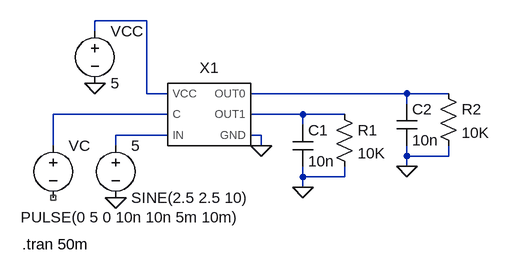
[diagram p0: schematic demux_test.asc]
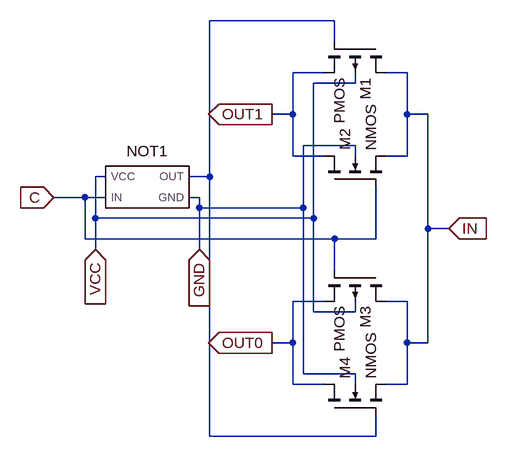
[diagram p1: sub-circuit demux_2to1.asc]
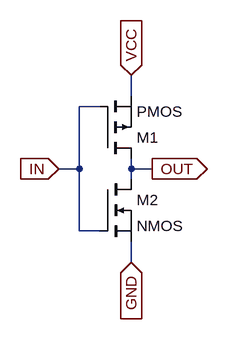
[diagram p2: sub-circuit not.asc]
demux_test.asc, the LTspice schematic file:
Version 4.1
SHEET 1 880 680
WIRE 112 0 32 0
WIRE 32 16 32 0
WIRE 112 112 112 0
WIRE 144 112 112 112
WIRE 512 112 272 112
WIRE 576 112 512 112
WIRE 512 128 512 112
WIRE 144 144 -32 144
WIRE 352 144 272 144
WIRE 416 144 352 144
WIRE 352 160 352 144
WIRE 144 176 64 176
WIRE 288 176 272 176
WIRE -32 192 -32 144
WIRE 64 192 64 176
WIRE 288 192 288 176
WIRE 512 208 512 192
WIRE 576 208 576 192
WIRE 576 208 512 208
WIRE 512 224 512 208
WIRE 352 240 352 224
WIRE 416 240 416 224
WIRE 416 240 352 240
WIRE 352 256 352 240
FLAG 64 272 0
FLAG 32 96 0
FLAG 288 192 0
FLAG 352 256 0
FLAG 512 224 0
SYMBOL demux_2to1 208 160 R0
SYMATTR InstName X1
SYMBOL voltage 64 176 R0
WINDOW 123 0 0 Left 0
WINDOW 39 0 0 Left 0
SYMATTR InstName 5
SYMATTR Value SINE(2.5 2.5 10)
SYMBOL voltage -32 176 R0
WINDOW 3 -50 126 Left 2
WINDOW 123 0 0 Left 0
WINDOW 39 0 0 Left 0
SYMATTR InstName VC
SYMATTR Value PULSE(0 5 0 10n 10n 5m 10m)
SYMBOL voltage 32 0 R0
SYMATTR InstName VCC
SYMATTR Value 5
SYMBOL res 400 128 R0
SYMATTR InstName R1
SYMATTR Value 10K
SYMBOL cap 336 160 R0
SYMATTR InstName C1
SYMATTR Value 10n
SYMBOL res 560 96 R0
SYMATTR InstName R2
SYMATTR Value 10K
SYMBOL cap 496 128 R0
SYMATTR InstName C2
SYMATTR Value 10n
TEXT -80 344 Left 2 !.tran 50m

demux_2to1.asc, the sub-circuit schematic file:
Version 4.1
SHEET 1 880 696
WIRE 192 48 0 48
WIRE 192 80 192 48
WIRE 176 128 128 128
WIRE 304 128 272 128
WIRE 224 144 224 128
WIRE 224 144 160 144
WIRE 128 192 128 128
WIRE 128 192 96 192
WIRE 304 192 304 128
WIRE 336 192 304 192
WIRE 224 240 144 240
WIRE 128 256 128 192
WIRE 176 256 128 256
WIRE 224 256 224 240
WIRE 304 256 304 192
WIRE 304 256 272 256
WIRE -160 288 -176 288
WIRE 0 288 0 48
WIRE 0 288 -32 288
WIRE -192 320 -240 320
WIRE -160 320 -192 320
WIRE -16 320 -32 320
WIRE -16 336 -16 320
WIRE 144 336 144 240
WIRE 144 336 -16 336
WIRE -176 352 -176 288
WIRE 160 352 160 144
WIRE 160 352 -176 352
WIRE 336 368 336 192
WIRE 368 368 336 368
WIRE -192 384 -192 320
WIRE 192 384 -192 384
WIRE 256 384 256 304
WIRE 256 384 192 384
WIRE -176 400 -176 352
WIRE -16 400 -16 336
WIRE 192 432 192 384
WIRE 176 480 128 480
WIRE 304 480 272 480
WIRE 160 496 160 352
WIRE 224 496 224 480
WIRE 224 496 160 496
WIRE 128 544 128 480
WIRE 128 544 96 544
WIRE 304 544 304 480
WIRE 336 544 336 368
WIRE 336 544 304 544
WIRE 144 592 144 336
WIRE 224 592 144 592
WIRE 128 608 128 544
WIRE 176 608 128 608
WIRE 224 608 224 592
WIRE 304 608 304 544
WIRE 304 608 272 608
WIRE 0 688 0 288
WIRE 256 688 256 656
WIRE 256 688 0 688
FLAG -240 320 C
IOPIN -240 320 In
FLAG -176 400 VCC
IOPIN -176 400 In
FLAG -16 400 GND
IOPIN -16 400 In
FLAG 368 368 IN
IOPIN 368 368 In
FLAG 96 192 OUT1
IOPIN 96 192 Out
FLAG 96 544 OUT0
IOPIN 96 544 Out
SYMBOL not -96 304 R0
SYMATTR InstName NOT1
SYMBOL pmos4 272 80 R90
SYMATTR InstName M1
SYMBOL pmos4 272 432 R90
SYMATTR InstName M3
SYMBOL nmos4 176 304 R270
SYMATTR InstName M2
SYMBOL nmos4 176 656 R270
SYMATTR InstName M4

not.asc, the sub-circuit schematic file:
Version 4.1
SHEET 1 880 680
WIRE 176 48 176 16
WIRE 128 64 96 64
WIRE 96 160 96 64
WIRE 96 160 64 160
WIRE 176 160 176 144
WIRE 208 160 176 160
WIRE 176 176 176 160
WIRE 96 256 96 160
WIRE 128 256 96 256
WIRE 176 304 176 272
FLAG 64 160 IN
IOPIN 64 160 In
FLAG 208 160 OUT
IOPIN 208 160 Out
FLAG 176 16 VCC
IOPIN 176 16 In
FLAG 176 304 GND
IOPIN 176 304 In
SYMBOL pmos 128 144 M180
SYMATTR InstName M1
SYMBOL nmos 128 176 R0
SYMATTR InstName M2

The netlist it stands for:
* demux_test.asc
X§X1 N003 0 N005 N001 N002 N004 demux_2to1
V§5 N005 0 SINE(2.5 2.5 10)
VC N003 NC_01 PULSE(0 5 0 10n 10n 5m 10m)
VCC N001 0 5
R1 N004 0 10K
C1 N004 0 10n
R2 N002 0 10K
C2 N002 0 10n

* block symbol definitions
.subckt demux_2to1 C GND IN VCC OUT0 OUT1
X§NOT1 GND C VCC N001 not
M1 IN N001 OUT1 VCC PMOS
M3 IN C OUT0 VCC PMOS
M2 OUT1 C IN GND NMOS
M4 OUT0 N001 IN GND NMOS
.ends demux_2to1

.subckt not GND IN VCC OUT
M1 OUT IN VCC VCC PMOS
M2 OUT IN GND GND NMOS
.ends not

.model NMOS NMOS
.model PMOS PMOS
.lib standard.mos
.tran 50m
.backanno
.end